# EAGLE design D18_1_1 (EAGLE 8.3.2)
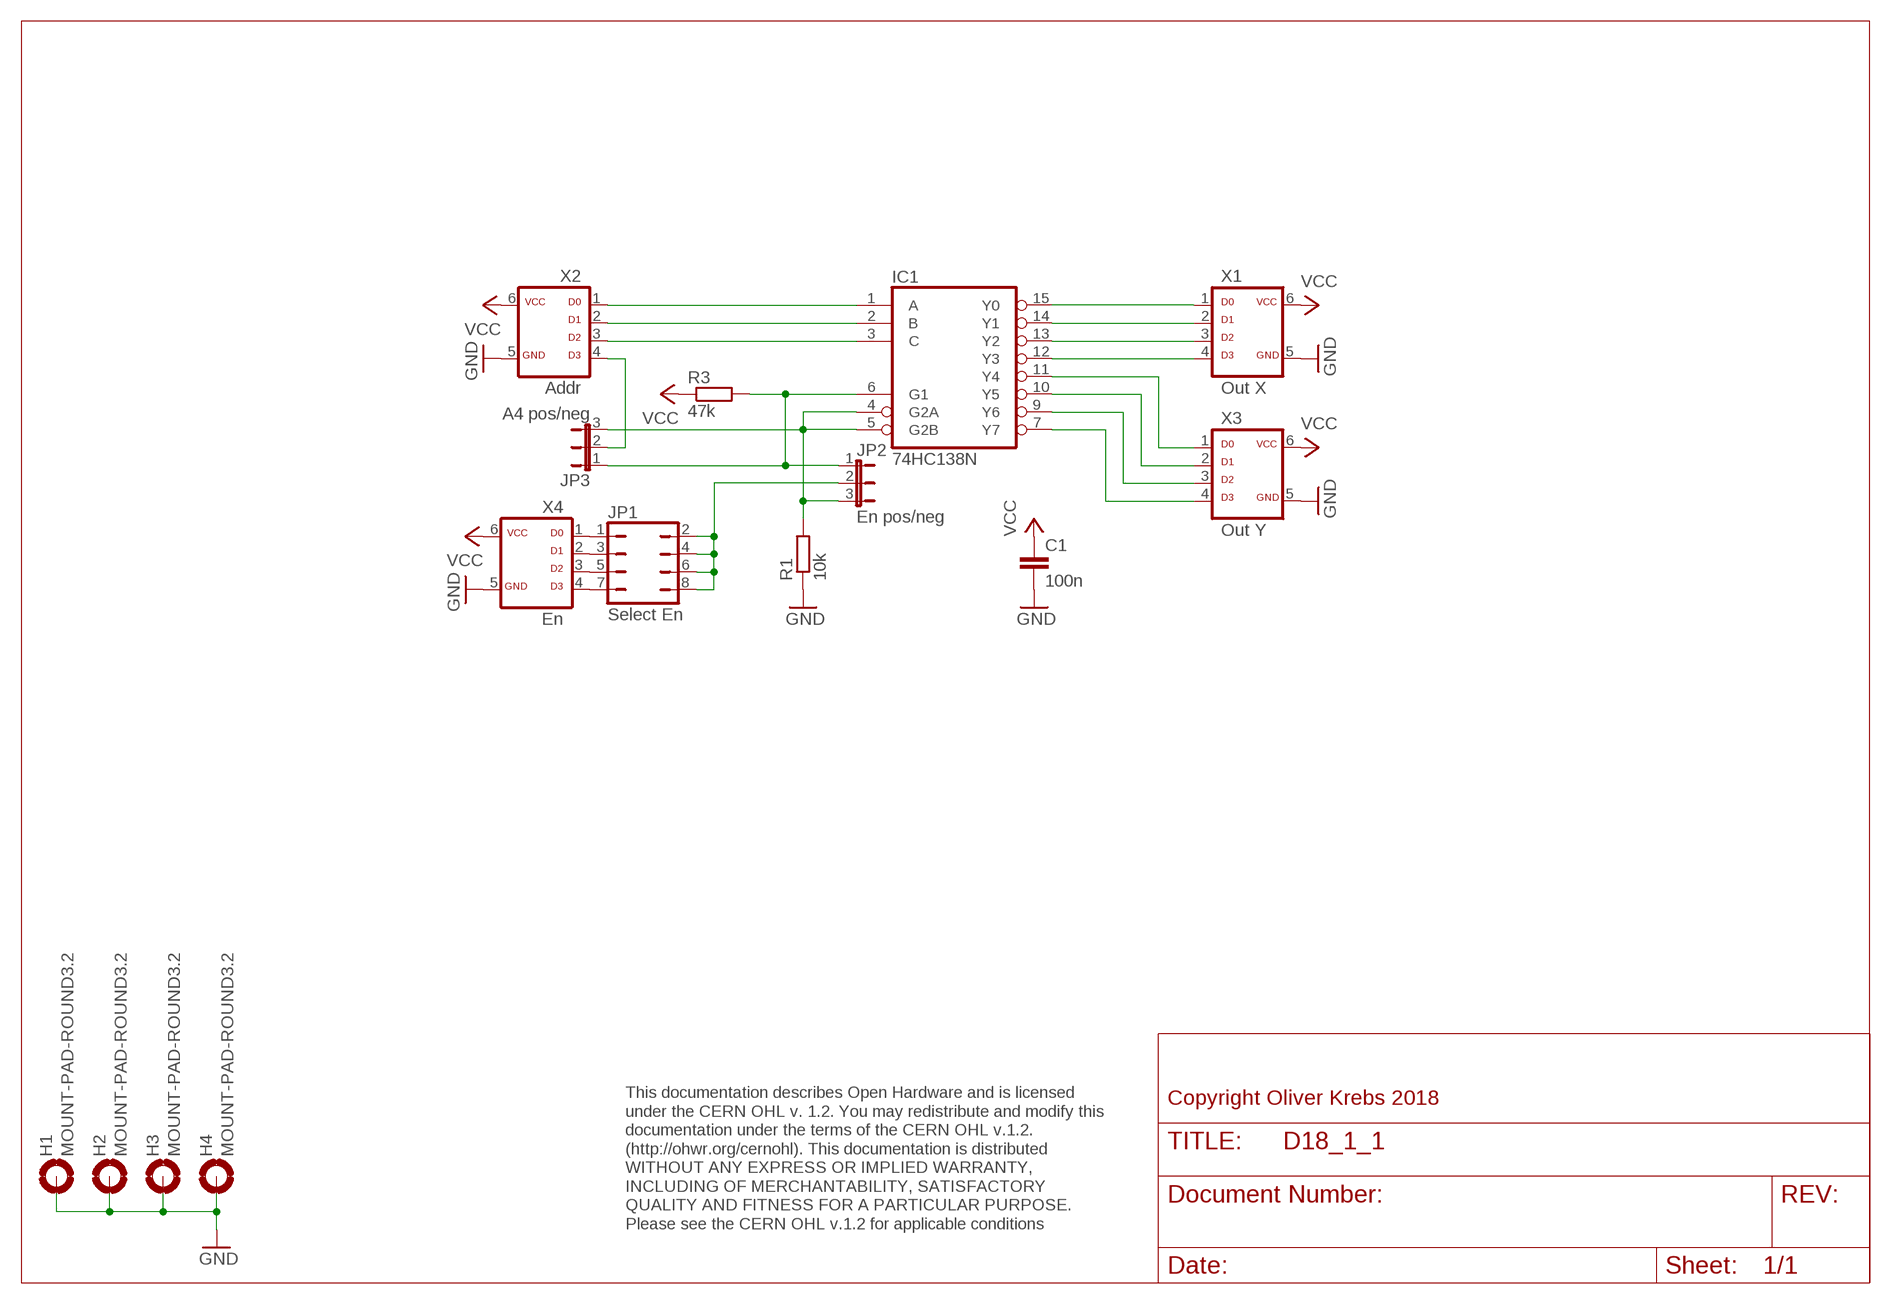
[diagram p0: schematic, sheet 1]

## Parts
C1  100n  C-EU050-025X075  [C050-025X075]
H1  MOUNT-PAD-ROUND3.2  [3,2-PAD]
H2  MOUNT-PAD-ROUND3.2  [3,2-PAD]
H3  MOUNT-PAD-ROUND3.2  [3,2-PAD]
H4  MOUNT-PAD-ROUND3.2  [3,2-PAD]
IC1  74HC138N  [DIL16]
JP1  Select En  JP4Q  [JP4Q]
JP2  En pos/neg  JP2EJP2-U  [JP2-U]
JP3  A4 pos/neg  JP2EJP2-U  [JP2-U]
R1  10k  R-EU_0207/10  [0207/10]
R3  47k  R-EU_0207/10  [0207/10]
X1  Out X  ML6D  [ML-6]
X2  Addr  ML6D  [ML-6]
X3  Out Y  ML6D  [ML-6]
X4  En  ML6D  [ML-6]

## Nets
GND: C1.2 H1.B3,2(MOUNT) H2.B3,2(MOUNT) H3.B3,2(MOUNT) H4.B3,2(MOUNT) R1.1 X1.5 X2.5 X3.5 X4.5
N$1: IC1.1(A) X2.1
N$2: IC1.2(B) X2.2
N$3: IC1.3(C) X2.3
N$4: JP3.2 X2.4
N$5: JP1.2 JP1.4 JP1.6 JP1.8 JP2.2
N$6: JP1.1 X4.1
N$7: JP1.3 X4.2
N$8: JP1.5 X4.3
N$9: JP1.7 X4.4
N$10: IC1.15(Y0) X1.1
N$11: IC1.14(Y1) X1.2
N$12: IC1.13(Y2) X1.3
N$13: IC1.12(Y3) X1.4
N$14: IC1.11(Y4) X3.1
N$15: IC1.10(Y5) X3.2
N$16: IC1.9(Y6) X3.3
N$17: IC1.7(Y7) X3.4
N$18: IC1.4(G2A) IC1.5(G2B) JP2.3 JP3.3 R1.2
N$19: IC1.6(G1) JP2.1 JP3.1 R3.2
VCC: C1.1 R3.1 X1.6 X2.6 X3.6 X4.6

## Notes on the sheet
- Copyright Oliver Krebs 2018
- This documentation describes Open Hardware and is licensed 
  under the CERN OHL v. 1.2. You may redistribute and modify this 
  documentation under the terms of the CERN OHL v.1.2. 
  (http://ohwr.org/cernohl). This documentation is distributed
  WITHOUT ANY EXPRESS OR IMPLIED WARRANTY, 
  INCLUDING OF MERCHANTABILITY, SATISFACTORY 
  QUALITY AND FITNESS FOR A PARTICULAR PURPOSE. 
  Please see the CERN OHL v.1.2 for applicable conditions

## Power pins joined to a net without a drawn wire
GND: IC1.8(GND)
VCC: IC1.16(VCC)

## Library data of the parts
C1 = 01-my_rcl:C-EU: CAPACITOR, European symbol
H1-H4 = holes:MOUNT-PAD-ROUND: MOUNTING PAD, round
IC1 = 74xx-eu:74*138: 3-line to 8-line DECODER/DEMULTIPLEXER
JP1 = 01-my-jumper:JP4Q: JUMPER
JP2 JP3 = 01-my-jumper:JP2E: JUMPER
R1 R3 = 01-my_rcl:R-EU_: RESISTOR, European symbol
X1-X4 = 01-my-con:ML6D

## Board
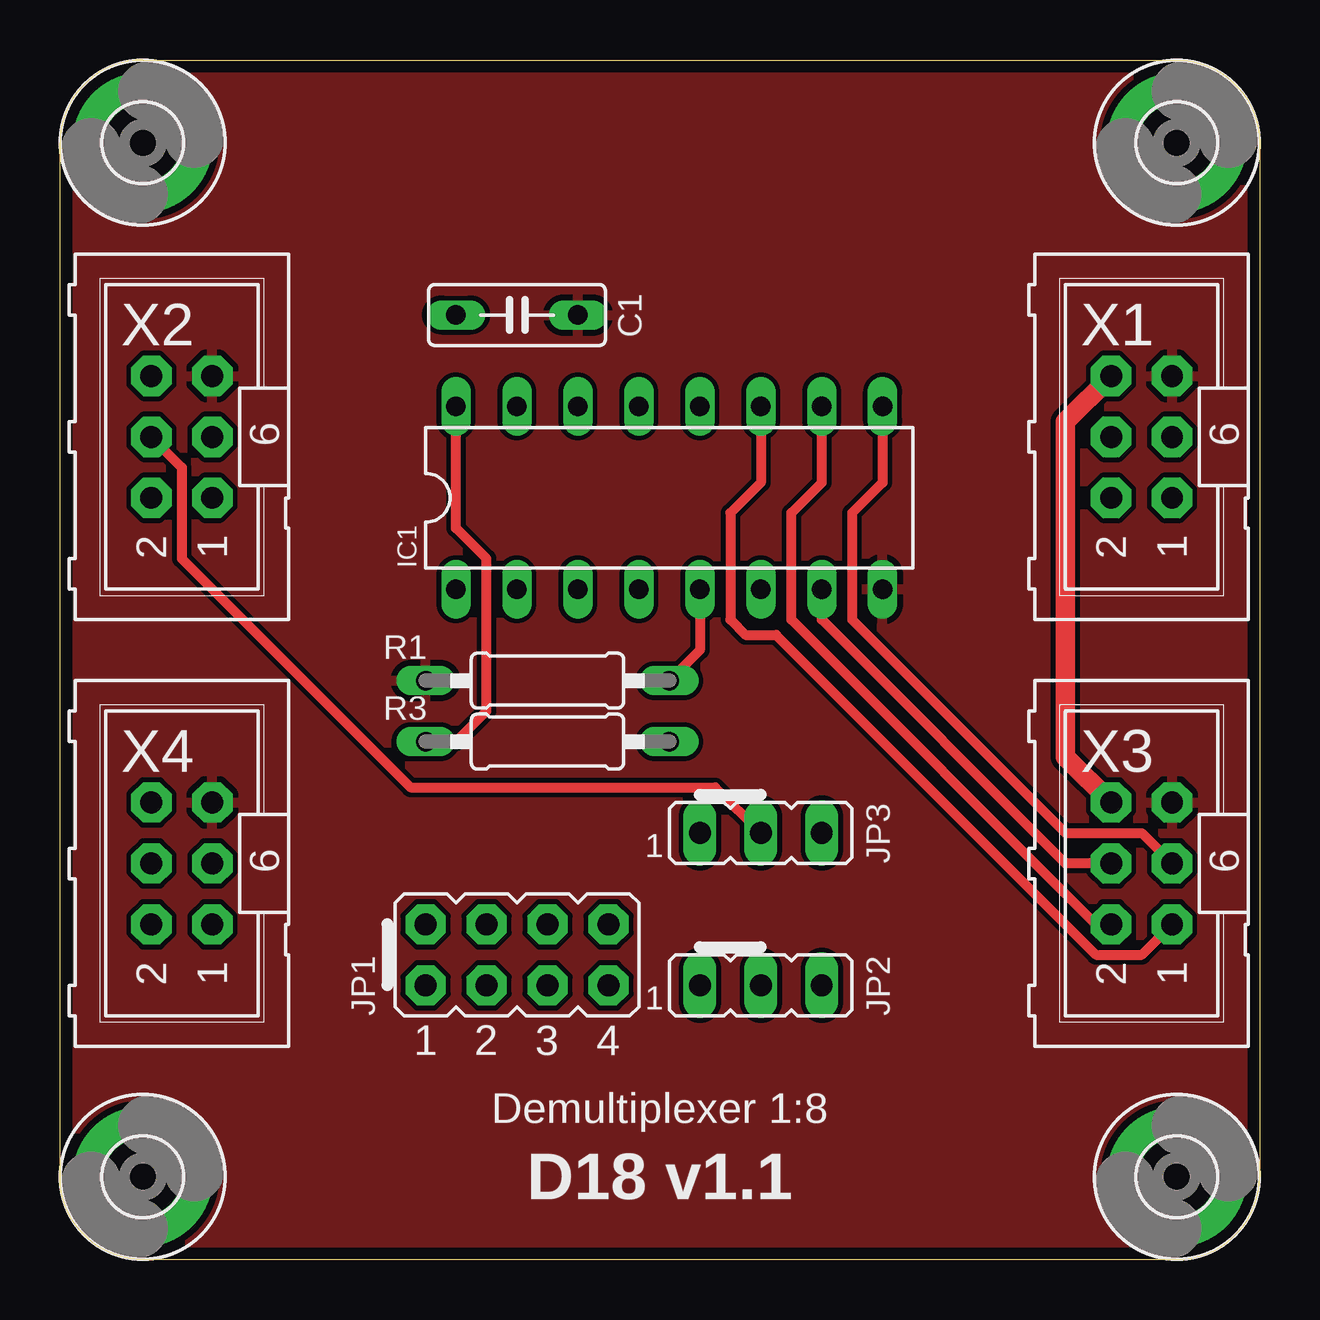
[diagram p1: board, top side]
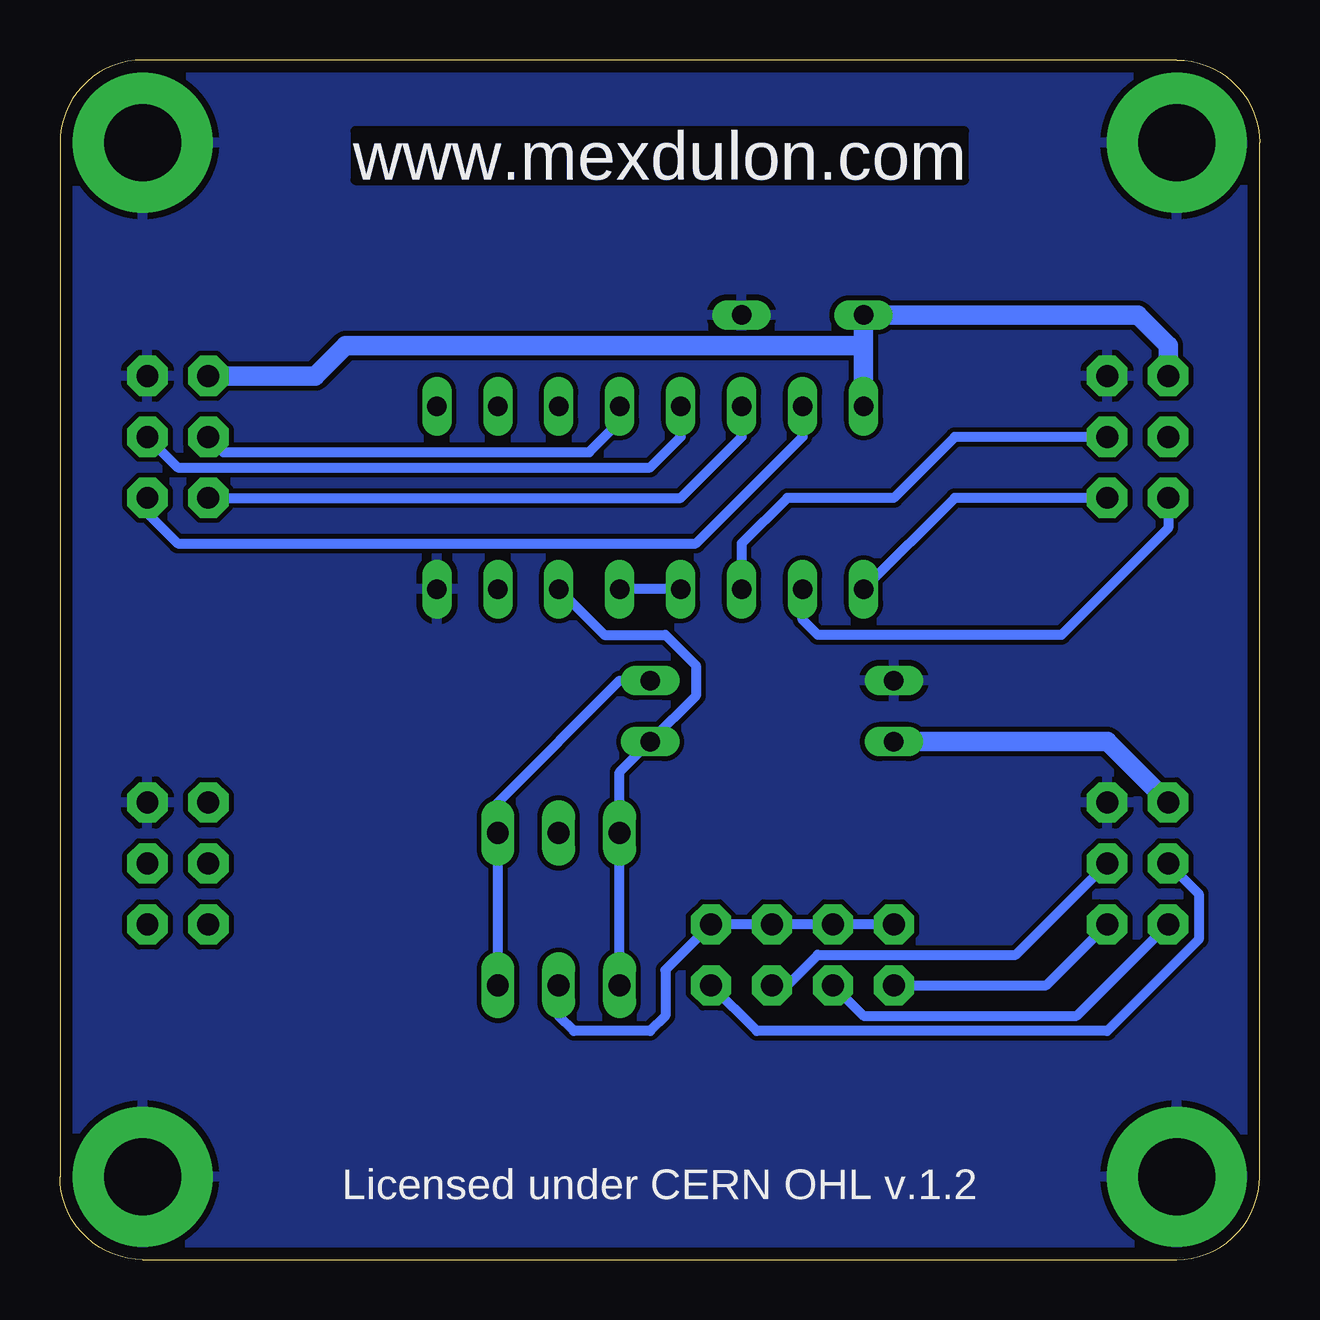
[diagram p2: board, bottom side, seen from below]

Size 50 x 50 mm. Coordinates in mm from the lower left corner, seen from the top.
Outline: 0,3.45 0,46.55 arc-90 3.45,50 46.55,50 arc-90 50,46.55 50,3.45 arc-90 46.55,0 3.45,0 arc-90 0,3.45
Copper layers (1*16): Top 0.035mm / dielectric 1.6mm / Bottom 0.035mm
Design rules "Elecrow_2-layer_PCB_eagle_rule_8mil": minimum track width 8mil, minimum drill 12mil, track to track 8mil, track to pad 8mil, pad to pad 8mil, via to via 8mil, smd to smd 0mil, copper to edge 20mil, drill to drill 10mil, minimum pad ring 6mil, minimum via ring 6mil, stop-mask expansion 0mil, vias tented up to drill 100mil, thermal gap 10mil

### Footprints (pad centres in the part's own frame; a part is rotated, then mirrored left to right if it is on the bottom)
C050-025X075 = drill 0.813 long: 1 -2.54,0; 2 2.54,0
3,2-PAD = drill 3.2 pad 5.842: B3,2 0,0
DIL16 = drill 0.813 long: 1 -8.89,-3.81; 2 -6.35,-3.81; 3 -3.81,-3.81; 4 -1.27,-3.81; 5 1.27,-3.81; 6 3.81,-3.81; 7 6.35,-3.81; 8 8.89,-3.81; 9 8.89,3.81; 10 6.35,3.81; 11 3.81,3.81; 12 1.27,3.81; 13 -1.27,3.81; 14 -3.81,3.81; 15 -6.35,3.81; 16 -8.89,3.81
JP4Q = drill 0.914 pad 1.676 octagon: 1 -3.81,-1.27; 2 -3.81,1.27; 3 -1.27,-1.27; 4 -1.27,1.27; 5 1.27,-1.27; 6 1.27,1.27; 7 3.81,-1.27; 8 3.81,1.27
JP2-U = drill 0.914 long: 1 -2.54,0; 2 0,0; 3 2.54,0
0207/10 = drill 0.813 long: 1 -5.08,0; 2 5.08,0
ML-6 = drill 0.914 pad 1.676 octagon: 1 -2.54,-1.27; 2 -2.54,1.27; 3 0,-1.27; 4 0,1.27; 5 2.54,-1.27; 6 2.54,1.27

### Placement (x,y rotation side)
C1  19.05,39.37 0 top
H1  3.45,3.45 0 top
H2  3.45,46.55 0 top
H3  46.55,46.55 0 top
H4  46.55,3.45 0 top
IC1  25.4,31.75 0 top
JP1  19.05,12.7 0 top
JP2  29.21,11.43 0 top
JP3  29.21,17.78 0 top
R1  20.32,24.13 0 top
R3  20.32,21.59 0 top
X1  45.09,34.29 90 top
X2  5.08,34.29 90 top
X3  45.09,16.51 90 top
X4  5.08,16.51 90 top

### Tracks (layer width: path | path; a pad name or v marks a point on that pad's centre or on a via)
GND
  pour Bottom (isolate 0.203): 0,50.16 50.8,50.16 50.8,0 0,0
  pour Top (isolate 0.203): 0,50.16 50.8,50.16 50.8,0 0,0
N$1
  Bottom 0.406: X2.1 12.7,31.75 IC1.1
N$2
  Bottom 0.406: X2.2 3.81,30.48 8.26,26.04 18.41,26.04 19.05,26.67 IC1.2
N$3
  Bottom 0.406: X2.3 12.7,34.29 15.24,31.75 19.68,31.75 21.59,29.84 IC1.3
N$4
  Top 0.406: X2.4 5.08,33.02 5.08,29.21 14.61,19.68 27.3,19.68 JP3.2
N$5
  Bottom 0.406: JP1.2 JP1.4 JP1.6 JP1.8 24.77,12.06 24.77,10.16 25.4,9.53 28.57,9.53 29.21,10.16 JP2.2
N$6
  Bottom 0.406: JP1.1 8.89,11.43 X4.1
N$7
  Bottom 0.406: JP1.3 16.51,10.16 7.62,10.16 X4.2
N$8
  Bottom 0.406: JP1.5 19.68,11.43 18.41,12.7 10.16,12.7 X4.3
N$9
  Bottom 0.406: X4.4 2.54,15.24 2.54,13.34 6.35,9.53 20.95,9.53 JP1.7
N$10
  Bottom 0.406: X1.1 46.35,31.11 45.09,29.84 23.5,29.84 19.05,34.29 IC1.15
N$11
  Bottom 0.406: X1.2 24.13,31.75 21.59,34.29 IC1.14
N$12
  Bottom 0.406: X1.3 45.09,33.02 25.4,33.02 24.13,34.29 IC1.13
N$13
  Bottom 0.406: X1.4 43.18,33.66 27.94,33.66 26.67,34.92 IC1.12
N$14
  Top 0.406: IC1.11 29.21,32.38 27.94,31.11 27.94,26.67 28.57,26.04 29.84,26.04 43.18,12.7 45.09,12.7 X3.1
N$15
  Top 0.406: X3.2 43.18,13.97 30.48,26.67 30.48,31.11 31.75,32.38 IC1.10
N$16
  Top 0.406: IC1.9 34.29,32.38 33.02,31.11 33.02,26.67 41.91,17.78 45.09,17.78 X3.3
N$17
  Top 0.406: X3.4 41.91,16.51 31.75,26.67 IC1.7
N$18
  Top 0.406: IC1.5 26.67,25.4 R1.2
  Bottom 0.406: R1.2 26.67,24.13 31.75,19.05 JP3.3 JP2.3 | IC1.4 IC1.5
N$19
  Bottom 0.406: JP2.1 JP3.1 26.67,20.32 R3.2 23.5,23.5 23.5,24.77 24.77,26.04 27.3,26.04 IC1.6
VCC
  Top 0.406: R3.1 16.51,21.59 17.78,22.86 17.78,29.21 16.51,30.48 IC1.16
  Top 0.813: X3.6 41.91,20.95 41.91,34.92 X1.6
  Bottom 0.813: R3.1 6.35,21.59 X4.6 | 16.51,38.1 C1.1 5.08,39.37 3.81,38.1 X2.6 | 16.51,38.1 IC1.16 | X1.6 39.37,36.83 38.1,38.1 16.51,38.1

### Text on the board
Bottom: www.mexdulon.com
tNames: Demultiplexer 1:8 | D18 v1.1
bNames: www.mexdulon.com | Licensed under CERN OHL v.1.2
200bmp: E:/Bilder/Elektronik/Modulion/Mexdulon/mexdulon_50x50_pcb.bmp